# EAGLE board perfect-cell-v0.1 (EAGLE 7.3.0)
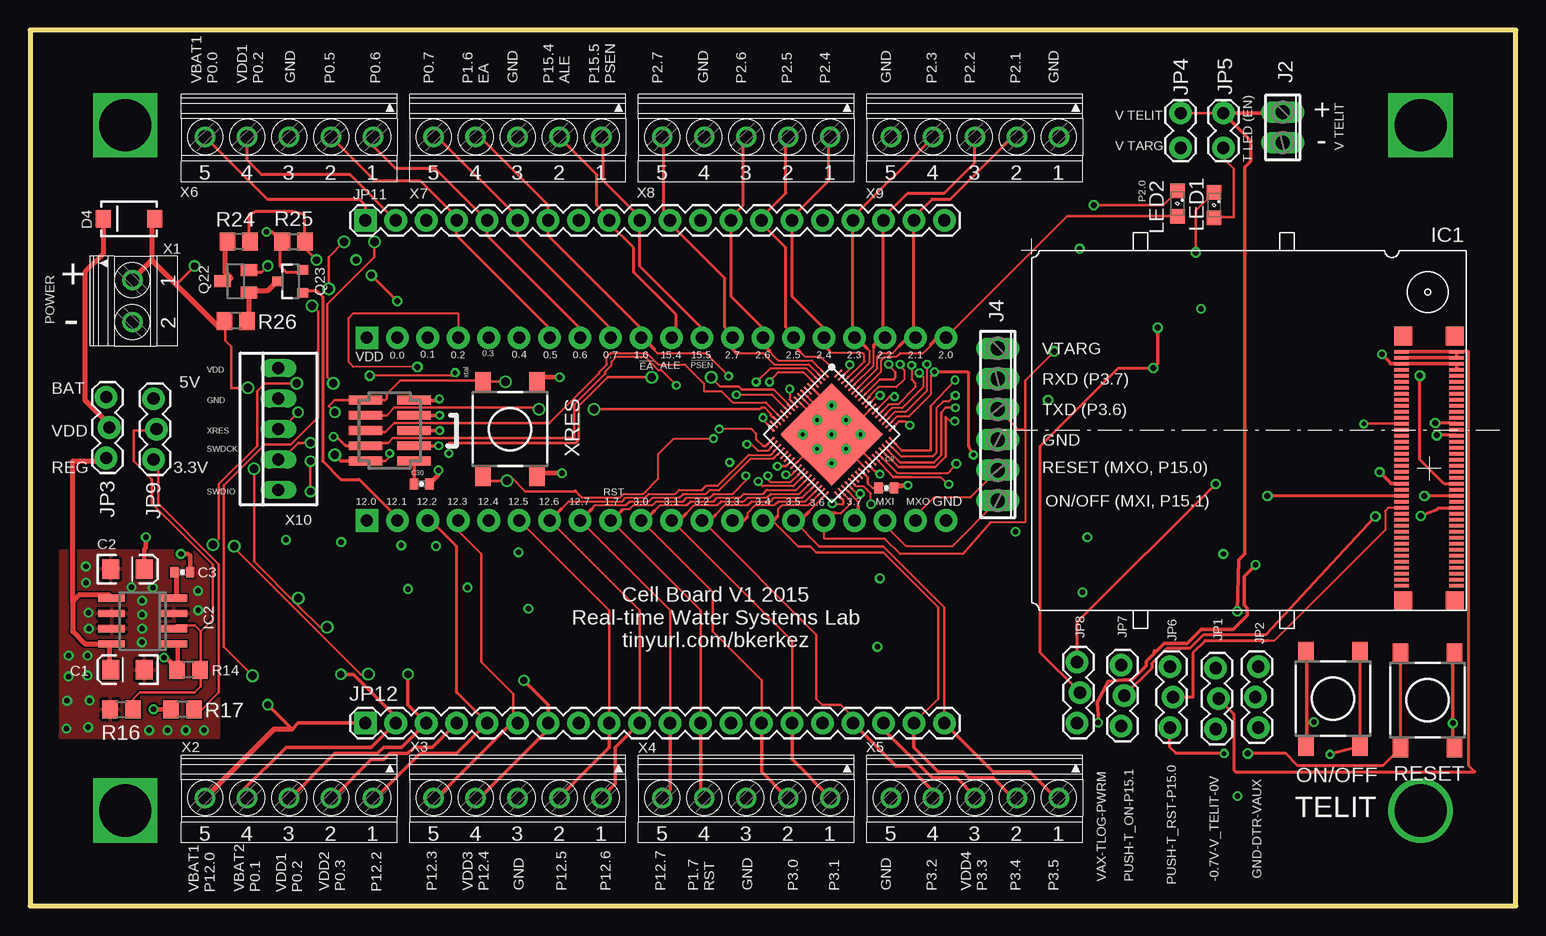
[diagram p3: board, top side]
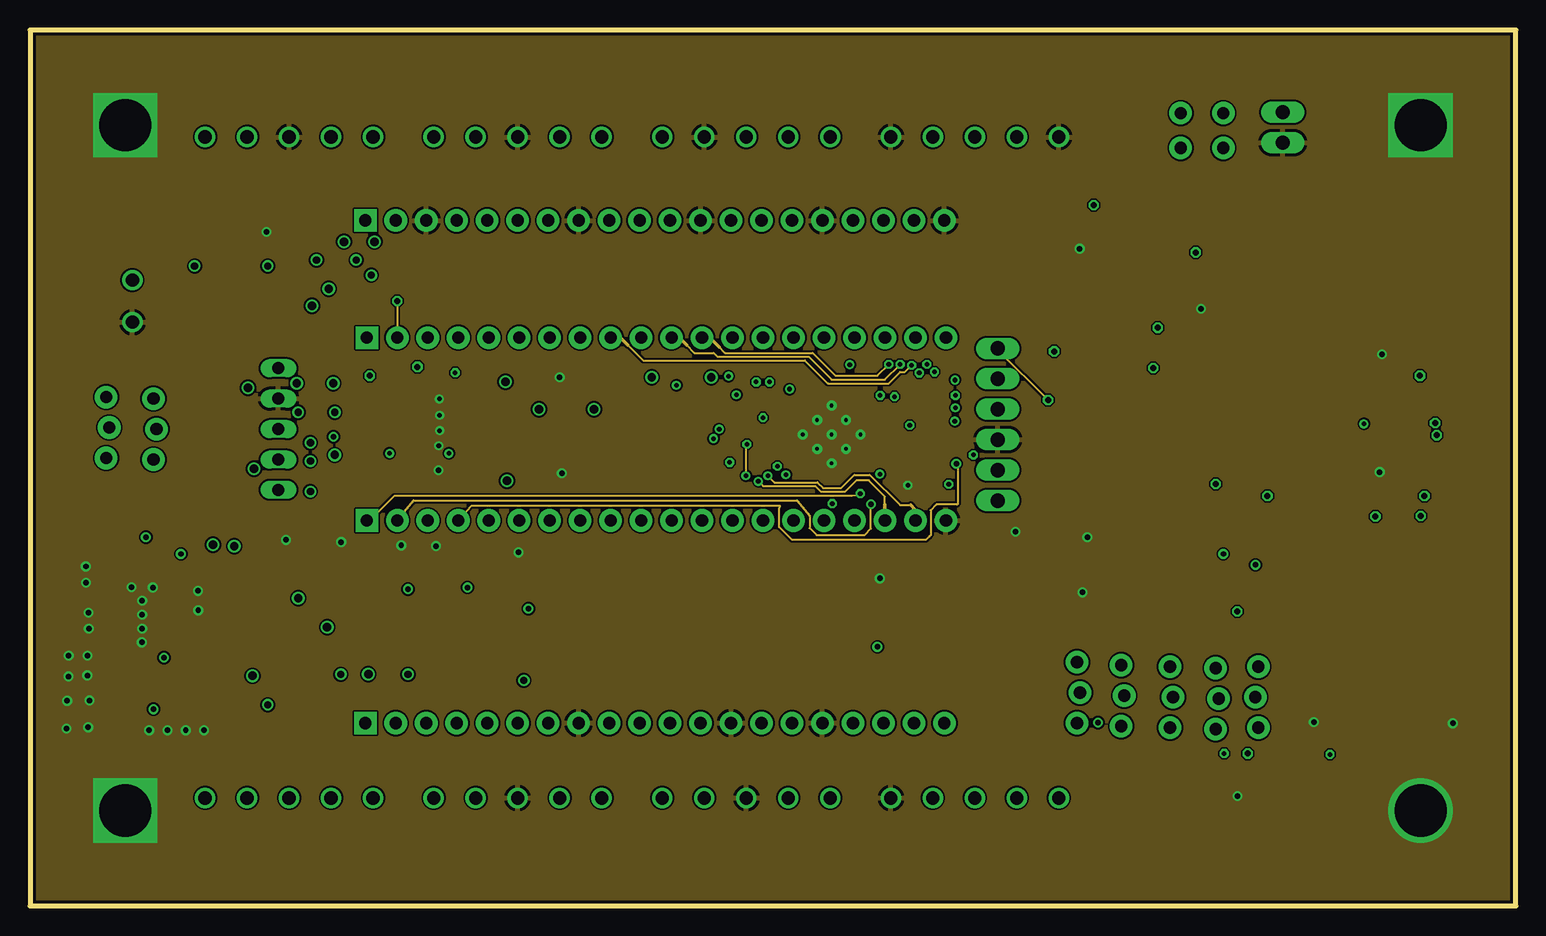
[diagram p4: board, inner layer Route2]
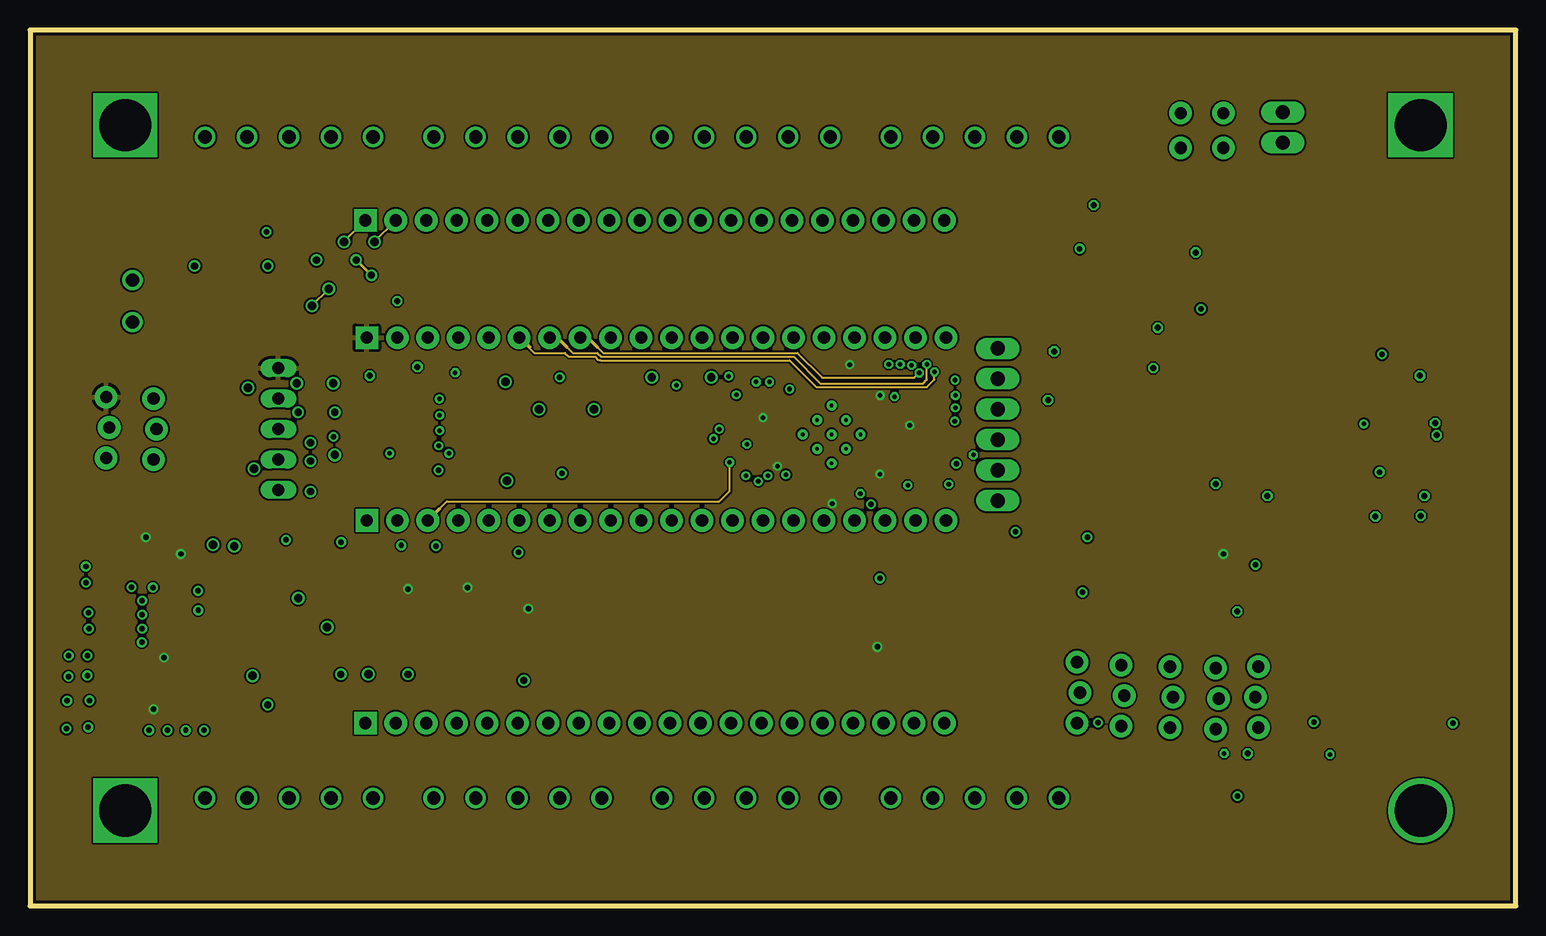
[diagram p5: board, inner layer Route15]
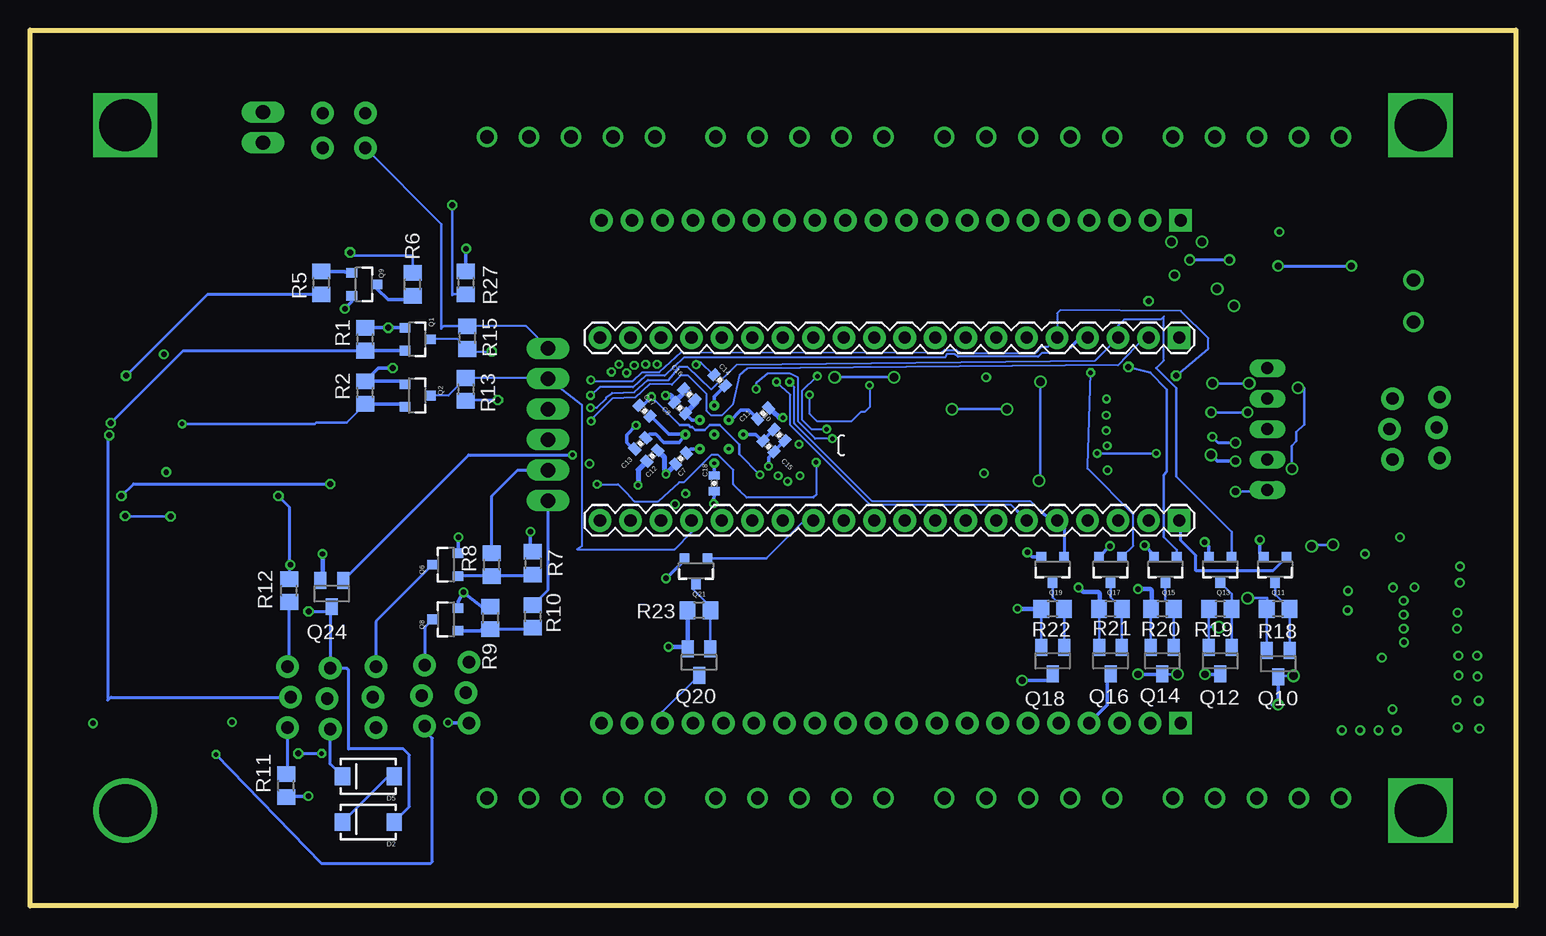
[diagram p6: board, bottom side, seen from below]

Size 123.83 x 73.03 mm. Coordinates in mm from the lower left corner, seen from the top.
Outline: 123.83,0 123.83,73.03 0,73.03 0,0 123.83,0
Copper layers (1*2+15*16): Top 0.035mm / dielectric 0.21mm / Route2 0.035mm / dielectric 0.21mm / Route15 0.035mm / dielectric 0.21mm / Bottom 0.035mm
Design rules "design_rules *": minimum track width 6mil, minimum drill 15mil, track to track 6mil, track to pad 6mil, pad to pad 6mil, via to via 6mil, smd to smd 0mil, copper to edge 10mil, drill to drill 20mil, minimum pad ring 10mil, minimum via ring 7mil, stop-mask expansion 6mil, vias tented up to drill 12mil, thermal gap 10mil

## Footprints (pad centres in the part's own frame; a part is rotated, then mirrored left to right if it is on the bottom)
EIA3216 = smd 1.4 x 1.6: A 1.4,0; C -1.4,0
0402-CAP = smd 0.7 x 0.9: 1 -0.65,0; 2 0.65,0
SMA-DIODE = smd 1.27 x 1.47: A -2.15,0; C 2.15,0
GC864 = smd 0.3 x 1.2: 1 -9.75,2.3; 2 -9.75,-2.3; 3 -9.25,2.3; 4 -9.25,-2.3; 5 -8.75,2.3; 6 -8.75,-2.3; 7 -8.25,2.3; 8 -8.25,-2.3; 9 -7.75,2.3; 10 -7.75,-2.3; 11 -7.25,2.3; 12 -7.25,-2.3; 13 -6.75,2.3; 14 -6.75,-2.3; 15 -6.25,2.3; 16 -6.25,-2.3; 17 -5.75,2.3; 18 -5.75,-2.3; 19 -5.25,2.3; 20 -5.25,-2.3; 21 -4.75,2.3; 22 -4.75,-2.3; 23 -4.25,2.3; 24 -4.25,-2.3; 25 -3.75,2.3; 26 -3.75,-2.3; 27 -3.25,2.3; 28 -3.25,-2.3; 29 -2.75,2.3; 30 -2.75,-2.3; 31 -2.25,2.3; 32 -2.25,-2.3; 33 -1.75,2.3; 34 -1.75,-2.3; 35 -1.25,2.3; 36 -1.25,-2.3; 37 -0.75,2.3; 38 -0.75,-2.3; 39 -0.25,2.3; 40 -0.25,-2.3; 41 0.25,2.3; 42 0.25,-2.3; 43 0.75,2.3; 44 0.75,-2.3; 45 1.25,2.3; 46 1.25,-2.3; 47 1.75,2.3; 48 1.75,-2.3; 49 2.25,2.3; 50 2.25,-2.3; 51 2.75,2.3; 52 2.75,-2.3; 53 3.25,2.3; 54 3.25,-2.3; 55 3.75,2.3; 56 3.75,-2.3; 57 4.25,2.3; 58 4.25,-2.3; 59 4.75,2.3; 60 4.75,-2.3; 61 5.25,2.3; 62 5.25,-2.3; 63 5.75,2.3; 64 5.75,-2.3; 65 6.25,2.3; 66 6.25,-2.3; 67 6.75,2.3; 68 6.75,-2.3; 69 7.25,2.3; 70 7.25,-2.3; 71 7.75,2.3; 72 7.75,-2.3; 73 8.25,2.3; 74 8.25,-2.3; 75 8.75,2.3; 76 8.75,-2.3; 77 9.25,2.3; 78 9.25,-2.3; 79 9.75,2.3; 80 9.75,-2.3 | smd 1.6 x 1.5: P$81 -11.05,2.15; P$82 -11.05,-2.15; P$83 11.05,2.15; P$84 11.05,-2.15
SOIC8 = smd 0.6 x 2.2: 1 -1.905,-2.6; 2 -0.635,-2.6; 3 0.635,-2.6; 4 1.905,-2.6; 5 1.905,2.6; 6 0.635,2.6; 7 -0.635,2.6; 8 -1.905,2.6
2POL254 = drill 1.2 long: 1 -1.27,0; 2 1.27,0
6POL254 = drill 1.2 pad 1.778 long: 1 -6.35,0; 2 -3.81,0; 3 -1.27,0; 4 1.27,0; 5 3.81,0; 6 6.35,0
1X03_LOCK = drill 1.016 pad 1.88: 1 0,0.127; 2 2.54,-0.127; 3 5.08,0.127
1X02_LOCK = drill 1.016 pad 1.88: 1 -0.178,0; 2 2.718,0
1X20 = drill 1.016 pad 1.88 square: 1 0,0 | drill 1.016 pad 1.88: 2 2.54,0; 3 5.08,0; 4 7.62,0; 5 10.16,0; 6 12.7,0; 7 15.24,0; 8 17.78,0; 9 20.32,0; 10 22.86,0; 11 25.4,0; 12 27.94,0; 13 30.48,0; 14 33.02,0; 15 35.56,0; 16 38.1,0; 17 40.64,0; 18 43.18,0; 19 45.72,0; 20 48.26,0
SML0805 = smd 1.2 x 1.2: A 1.05,0; C -1.05,0
DTSM-6 = smd 1.55 x 1.3: 1 -3.975,2.25; 2 3.975,2.25; 3 -3.975,-2.25; 4 3.975,-2.25
SOT23-3 = smd 0.8 x 0.9: 1 -0.95,-1; 2 0.95,-1; 3 0,1.1
FTSH-105-01-XXX-DV-K = smd 0.737 x 2.794: 1 -2.54,-2.032; 2 -2.54,2.032; 3 -1.27,-2.032; 4 -1.27,2.032; 5 0,-2.032; 6 0,2.032; 7 1.27,-2.032; 8 1.27,2.032; 9 2.54,-2.032; 10 2.54,2.032
SOT23 = smd 1 x 1.4: 1 -0.95,-1.1; 2 0.95,-1.1; 3 0,1.1
R0805 = smd 1.3 x 1.5: 1 -0.95,0; 2 0.95,0
QFN-68 = smd 0.9 x 0.2: 1 -4,3.2; 2 -4,2.8; 3 -4,2.4; 4 -4,2; 5 -4,1.6; 6 -4,1.2; 7 -4,0.8; 8 -4,0.4; 9 -4,0; 10 -4,-0.4; 11 -4,-0.8; 12 -4,-1.2; 13 -4,-1.6; 14 -4,-2; 15 -4,-2.4; 16 -4,-2.8; 17 -4,-3.2; 35 4,-3.2; 36 4,-2.8; 37 4,-2.4; 38 4,-2; 39 4,-1.6; 40 4,-1.2; 41 4,-0.8; 42 4,-0.4; 43 4,0; 44 4,0.4; 45 4,0.8; 46 4,1.2; 47 4,1.6; 48 4,2; 49 4,2.4; 50 4,2.8; 51 4,3.2 | smd 0.2 x 0.9: 18 -3.2,-4; 19 -2.8,-4; 20 -2.4,-4; 21 -2,-4; 22 -1.6,-4; 23 -1.2,-4; 24 -0.8,-4; 25 -0.4,-4; 26 0,-4; 27 0.4,-4; 28 0.8,-4; 29 1.2,-4; 30 1.6,-4; 31 2,-4; 32 2.4,-4; 33 2.8,-4; 34 3.2,-4; 52 3.2,4; 53 2.8,4; 54 2.4,4; 55 2,4; 56 1.6,4; 57 1.2,4; 58 0.8,4; 59 0.4,4; 60 0,4; 61 -0.4,4; 62 -0.8,4; 63 -1.2,4; 64 -1.6,4; 65 -2,4; 66 -2.4,4; 67 -2.8,4; 68 -3.2,4 | drill 0.305: P$1 -1.705,-1.705; P$2 0,-1.705; P$3 1.705,-1.705; P$4 1.705,0; P$5 0,0; P$6 -1.705,0; P$7 -1.705,1.705; P$8 0,1.705; P$9 1.705,1.705 | smd 6.1 x 6.1: PAD 0,0
1751248 = drill 1.1 pad 1.7: 1 -1.75,-0.1; 2 1.75,-0.1
1751277 = drill 1.1 pad 1.7: 1 -7,-0.1; 2 -3.5,-0.1; 3 0,-0.1; 4 3.5,-0.1; 5 7,-0.1
22-23-2051 = drill 1 long: 1 -5.08,0; 2 -2.54,0; 3 0,0; 4 2.54,0; 5 5.08,0

## Placement (x,y rotation side)
C1  10uF  [EIA3216]  8.13,19.68 180 top
C2  10uF  [EIA3216]  8.13,28.07 0 top
C3  0.1 uF  [0402-CAP]  12.7,27.81 180 top
C7  0.1uF  [0402-CAP]  69.58,37.29 45 bottom
C8  1.0uF  [0402-CAP]  69.67,41.51 315 bottom
C9  1.0uF  [0402-CAP]  71.36,34.83 0 top
C10  0.1uF  [0402-CAP]  61.38,39.25 135 bottom
C11  0.1uF  [0402-CAP]  62.73,41.05 225 bottom
C12  1.0uF  [0402-CAP]  71.97,37.52 225 bottom
C13  0.1uF  [0402-CAP]  72.97,38.55 45 bottom
C14  0.1uF  [0402-CAP]  66.35,43.82 315 bottom
C15  1.0uF  [0402-CAP]  62.27,38.31 135 bottom
C16  0.1uF  [0402-CAP]  68.89,42.63 315 bottom
C17  1.0uF  [0402-CAP]  72.61,41.27 315 bottom
C18  0.1uF  [0402-CAP]  66.8,35.23 90 bottom
C30  0.1uF  [0402-CAP]  32.64,35.18 0 top
D2  [SMA-DIODE]  95.63,6.99 180 bottom
D4  [SMA-DIODE]  8.26,57.28 180 top
D5  [SMA-DIODE]  95.63,10.79 180 bottom
IC1  GC864  [GC864]  116.59,36.45 270 top
IC2  LT1763CS8-3.3  [SOIC8]  9.4,23.75 90 top
J2  [2POL254]  104.39,64.9 270 top
J4  [6POL254]  80.64,40.13 270 top
JP1  [1X03_LOCK]  98.93,14.73 90 top
JP2  [1X03_LOCK]  102.23,19.94 270 top
JP3  [1X03_LOCK]  6.48,37.34 90 top
JP4  [1X02_LOCK]  95.89,65.91 270 top
JP5  [1X02_LOCK]  99.44,65.91 270 top
JP6  [1X03_LOCK]  95.12,14.86 90 top
JP7  [1X03_LOCK]  91.06,14.99 90 top
JP8  [1X03_LOCK]  87.38,15.24 90 top
JP9  [1X03_LOCK]  10.41,37.21 90 top
JP11  [1X20]  27.94,57.15 0 top
JP12  [1X20]  27.94,15.24 0 top
JP13  M20  [1X20]  28.07,32.13 180 bottom
JP14  M20  [1X20]  28.07,47.37 180 bottom
LED1  [SML0805]  98.68,58.42 270 top
LED2  [SML0805]  95.63,58.55 270 top
ON/OFF  DTSM-6  [DTSM-6]  108.58,17.27 270 top
Q1  BSS138  [SOT23-3]  91.57,47.24 270 bottom
Q2  BSS138  [SOT23-3]  91.57,42.55 270 bottom
Q3  2X5  [FTSH-105-01-XXX-DV-K]  29.97,39.62 90 top
Q6  BSS138  [SOT23-3]  89.15,28.45 90 bottom
Q8  BSS138  [SOT23-3]  89.15,23.88 90 bottom
Q9  BSS138  [SOT23-3]  96.01,51.82 270 bottom
Q10  BSS84  [SOT23]  19.81,20.19 180 bottom
Q11  BSS138  [SOT23-3]  20.07,28.07 180 bottom
Q12  BSS84  [SOT23]  24.64,20.45 180 bottom
Q13  BSS138  [SOT23-3]  24.64,28.07 180 bottom
Q14  BSS84  [SOT23]  29.46,20.45 180 bottom
Q15  BSS138  [SOT23-3]  29.21,28.07 180 bottom
Q16  BSS84  [SOT23]  33.78,20.45 180 bottom
Q17  BSS138  [SOT23-3]  33.78,28.07 180 bottom
Q18  BSS84  [SOT23]  38.61,20.45 180 bottom
Q19  BSS138  [SOT23-3]  38.61,28.07 180 bottom
Q20  BSS84  [SOT23]  68.07,20.32 180 bottom
Q21  BSS138  [SOT23-3]  68.33,27.94 180 bottom
Q22  BSS84  [SOT23]  17.14,52.07 90 top
Q23  BSS138  [SOT23-3]  21.72,52.07 90 top
Q24  BSS84  [SOT23]  98.68,26.04 180 bottom
R1  10K  [R0805]  95.89,47.24 90 bottom
R2  10K  [R0805]  95.89,42.8 90 bottom
R5  330  [R0805]  99.57,51.94 270 bottom
R6  330  [R0805]  91.95,51.82 90 bottom
R7  10K  [R0805]  81.92,28.57 270 bottom
R8  330  [R0805]  85.34,28.45 90 bottom
R9  10K  [R0805]  85.47,24 270 bottom
R10  330  [R0805]  81.92,24.13 90 bottom
R11  10K  [R0805]  102.49,10.03 90 bottom
R12  10K  [R0805]  102.23,26.29 90 bottom
R13  10K  [R0805]  87.5,43.05 270 bottom
R14  750K  [R0805]  13.21,19.68 180 top
R15  10K  [R0805]  87.38,47.37 90 bottom
R16  240K  [R0805]  7.62,16.38 0 top
R17  909K  [R0805]  12.7,16.38 180 top
R18  100K  [R0805]  19.81,24.77 180 bottom
R19  100K  [R0805]  24.64,24.77 180 bottom
R20  100K  [R0805]  29.46,24.77 180 bottom
R21  100K  [R0805]  33.78,24.77 180 bottom
R22  100K  [R0805]  38.61,24.77 180 bottom
R23  100K  [R0805]  68.07,24.64 180 bottom
R24  10K  [R0805]  17.4,55.37 180 top
R25  1K  [R0805]  21.97,55.37 0 top
R26  100K  [R0805]  17.14,48.77 180 top
R27  330  [R0805]  87.5,51.94 270 bottom
RESET  DTSM-6  [DTSM-6]  116.46,17.14 90 top
U$1  CY8C3X66LTI  [QFN-68]  66.8,39.3 315 top
X1  1751248  [1751248]  8.64,50.42 270 top
X2  1751277  [1751277]  21.59,8.89 180 top
X3  1751277  [1751277]  40.64,8.89 180 top
X4  1751277  [1751277]  59.69,8.89 180 top
X5  1751277  [1751277]  78.74,8.89 180 top
X6  1751277  [1751277]  21.59,64.01 180 top
X7  1751277  [1751277]  40.64,64.01 180 top
X8  1751277  [1751277]  59.69,64.01 180 top
X9  1751277  [1751277]  78.74,64.01 180 top
X10  22-23-2051  [22-23-2051]  20.7,39.75 90 top
XRES  DTSM-6  [DTSM-6]  40.01,39.75 90 top

## Tracks (layer width: path | path; a pad name or v marks a point on that pad's centre or on a via)
!EA  (via drill 0.38)
  Top 0.152: U$1.18 61.77,38.8 | v58.22,44.16 56.33,46.1 52.28,46.1 51.32,47.05 JP14.10
  Top 0.178: 60.53,38.88 60.53,39.35 60.13,39.75 v57.44,39.75
  Top 0.203: U$1.18 61.3,38.32 61.09,38.32 60.53,38.88
  Top 0.254: JP14.10 51.31,47.75 43.18,55.88 JP11.7 43.18,58.42 37.59,64.01 X7.4
  Top 0.305: 51.32,47.05 51.4,47.05 52.04,46.42
  Bottom 0.152: v57.44,39.75 58.71,39.75 59.5,40.55 59.5,42.93 v58.22,44.16
!PSEN  (via drill 0.38)
  Top 0.203: 71.56,45.19 v71.56,45.15 71.56,45.07 72.12,44.51 72.12,44.04 71.96,43.88 70.81,43.88 U$1.61
  Top 0.254: JP14.12 56.39,47.75 50.8,53.34 JP11.10 50.8,57.4 47.75,60.45 47.75,64.01 X7.1
  Route2 0.152: 57.44,46.58 57.91,46.1 65.22,46.1 67.12,44.2 70.61,44.2 v71.56,45.15 | JP14.12 56.64,47.37
  Route2 0.305: 56.64,47.37 57.44,46.58
!XRES  (via drill 0.38, 0.6, 0.7)
  Top 0.152: 45.53,34.51 45.74,34.31 46.01,34.04 49.18,34.04 49.5,34.35 51.09,34.35 52.36,35.62 52.36,37.69 53.63,38.96 v56.96,38.96 | v56.96,38.96 | v63.31,43.09 63.31,42.23
  Top 0.203: 45.43,34.62 45.53,34.51 | 63.31,42.23 U$1.10 | v22.35,41.15 21.34,40.13 20.83,40.13 X10.3 | v25.4,41.15 24.89,41.66 25.4,42.16 Q3.10 29.59,42.16 29.72,42.29 29.72,42.67 30.86,43.81 37.67,43.81 XRES.2 39.59,43.73 v39.62,43.69 | 45.74,34.31 45.5,34.54 41.27,34.54 40.04,35.78 40.04,35.73 v39.75,35.43 38.1,35.43 XRES.1
  Bottom 0.152: v56.96,38.96 58.39,38.96 59.82,40.39 59.82,44.04 60.45,44.37 62.36,44.37 63.31,43.57 v63.31,43.09
  Bottom 0.203: v25.4,41.15 v22.35,41.15 | v39.62,43.69 39.62,35.56 v39.75,35.43
ALE  (via drill 0.38)
  Top 0.152: v72.52,45.15 72.52,45.02 72.83,44.67 72.83,43.88 72.2,43.24 70.69,43.24 69.98,42.53 69.98,42.45 | 69.59,42.06 U$1.60
  Top 0.203: 69.98,42.45 69.59,42.06
  Top 0.254: JP14.11 53.85,47.75 53.85,49.28 50.29,52.83 50.29,54.86 48.26,56.9 JP11.9 48.26,57.4 47.24,58.42 47.24,60.96 44.2,64.01 X7.2
  Route2 0.152: v72.52,45.15 71.25,43.88 66.8,43.88 64.9,45.78 57.28,45.78 56.96,46.1 55.37,46.1 54.74,46.74 | JP14.11 54.02,47.37
  Route2 0.305: 54.02,47.37 54.1,47.37 54.74,46.74
DTR  (via drill 0.5)
  Top 0.254: IC1.29 118.84,39.24 v117.22,39.24
  Bottom 0.254: v117.22,39.24 117.35,39.12 117.35,17.14 117.09,17.4 JP2.2
GND  (via drill 0.38, 0.46, 4.34)
  Top 0.152: 64.78,37.85 64.9,37.85 66.35,39.3 U$1.P$5 | U$1.5 66.8,41.56 U$1.P$5 | U$1.P$5 66.8,40.43 | U$1.P$5 66.8,39.87
  Top 0.203: U$1.25 64.78,37.85 | 66.8,40.43 U$1.7 | 66.8,39.87 U$1.8 | U$1.P$5 U$1.9 | C9.2 71.88,35.03 | 67.12,36.1 66.8,36.42 U$1.P$3 | U$1.45 69.14,38.1 U$1.P$4 U$1.43 | U$1.58 69.14,40.51 U$1.P$8
  Top 0.254: U$1.5 66.08,42.29 66.72,42.37 | Q23.2 22.35,52.83 21.34,52.83 20.83,53.34 20.83,55.37 R25.1
  Top 0.305: ON/OFF.4 106.4,13.36 106.4,15.24 | 106.4,15.24 106.48,15.32 v106.98,15.32 | RESET.3 118.57,13.31 v118.57,15.21 118.57,20.98 RESET.4 | ON/OFF.3 106.43,21.16 106.43,20.88 106.4,20.85 106.4,15.24 | IC1.7 IC1.5 IC1.6 113.37,45.2 113.33,45.24 113.33,45.31 v112.67,45.97 | IC1.46 113.39,35.2 113.39,35.25 v112.47,36.17 | Q3.7 v34.14,40.89 | Q3.5 v34.14,39.62 | Q3.3 v34.06,38.35 | Q3.9 32,42.14 31.98,42.11 33.96,42.11 v34.11,42.27 | R25.1 20.21,56.19 v19.71,56.19
  Top 0.356: XRES.3 42.55,36.07 v44.32,36.07 | XRES.4 42.6,44.07 v44.15,44.07 | C30.2 34.04,35.93 v34.04,36.32
  Top 0.406: 67.28,36.42 67.12,36.1 | 71.88,35.03 72.64,35.03 v73.15,35.07
  Bottom 0.305: C13.2 72.17,39.33 71.7,39.33 71.01,38.64 69.73,38.64 U$1.P$9 69.28,39.35 70.61,39.35 72.07,40.81 C17.2 | C11.2 63.94,41.34 64.58,41.34 65.48,40.44 U$1.P$6 | C10.2 62.73,38.83 | 62.73,38.83 C15.2 | U$1.P$3 66.8,37.03 C18.2 | 62.73,38.83 62.76,38.8 62.83,38.8 63.34,39.3 U$1.P$1 | C14.2 66.8,42.45 U$1.P$7 | C8.2 68.67,40.51 U$1.P$8 | C7.2 68.77,38.1 U$1.P$4 | R11.1 102.43,9.14 v100.64,9.14 | R27.1 87.5,54.76 v87.48,54.79 | Q9.2 97.01,50.36 v97.59,49.78 | R9.1 86.22,24.95 v87.71,26.14 88.15,25.38 Q8.2 | R7.1 82.15,29.52 v82.12,31.19 | Q6.2 88.15,30.69 v88.11,30.73 | Q15.2 30.16,29.27 v30.94,30.05 | Q17.2 34.73,29.1 v33.83,30 | Q19.2 40.32,29.07 v40.72,29.46 | Q13.2 25.59,29.98 v25.93,30.33 | Q21.2 69.28,28.84 v70.81,27.3 | Q11.2 21.34,29.39 v21.34,30.5
  Bottom 0.406: C8.2 68.24,42.01 C16.2 | C14.2 65.93,43.36 66.09,43.16 | C12.2 73.15,36.34 v73.15,35.07
  other vias: 7.94,7.94 7.94,65.09 115.89,65.09 115.89,7.94 9.35,25.45 9.35,24.28 9.35,23.11 9.32,21.97 4.88,24.43 4.9,23.11 14,26.26 14.02,24.64 10.24,26.54 8.46,26.57 4.8,20.85 4.67,26.95 4.78,19.2 4.95,17.12 4.85,14.88 3.05,14.78 3.1,17.09 3.2,19.13 3.23,20.85 4.65,28.3 9.93,14.63 11.46,14.63 12.98,14.63 14.5,14.63
  pour Route2: 0,0 123.83,0 123.83,73.03 0,73.03
  pour Top: 2.57,29.59 15.75,29.59 15.75,14.05 2.51,14.05 2.51,14.33 2.57,14.33 2.57,29.57
MXI  (via drill 0.38)
  Top 0.152: U$1.28 63.62,34.99 61.01,34.99 60.69,35.31 v60.69,35.38 | J4.6 76.83,29.97 73.03,29.97 71.25,31.75 JP13.18
  Route2 0.152: JP13.18 71.25,32.61 | 71.25,33.48 71.25,34.12 69.9,35.47 68.87,35.47 67.91,34.51 65.93,34.51 65.45,34.99 61.09,34.99 v60.69,35.38
  Route2 0.305: 71.25,32.61 71.25,33.48
  Bottom 0.254: R10.2 80.64,26.35 J4.6
MXO  (via drill 0.38)
  Top 0.152: U$1.27 63.37,35.31 61.72,35.31 61.48,35.54 v61.48,35.86 | J4.5 78.36,34.04 75.31,34.04 73.79,32.51 JP13.19
  Route2 0.152: 73.79,32.92 73.79,32.77 JP13.19 | 73.39,33.4 72.52,33.4 69.98,35.94 68.71,35.94 67.6,34.83 66.09,34.83 65.61,35.31 62.04,35.31 v61.48,35.86
  Route2 0.305: 73.79,32.77 73.79,33 73.39,33.4
  Bottom 0.254: R8.2 85.34,34.16 83.19,36.32 J4.5
N$1
  Bottom 0.254: R7.2 82.04,27.5 R8.1 Q6.1
N$2
  Top 0.254: JP1.2 100.33,16 100.33,11.3 100.46,11.18 120.4,11.18 119.89,11.68 119.89,46.23 119.86,46.2 IC1.1
  Top 0.305: IC1.2 IC1.1 IC1.3 IC1.4
N$3
  Bottom 0.254: D2.C 93.97,10.79 D5.A
N$4
  Bottom 0.305: R6.1 92.27,50.55 93.98,50.55 94.91,51.48 Q9.3
N$5
  Top 0.406: JP3.2 6.6,40.13 4.57,42.16 4.57,52.83 6.1,54.36 6.1,56.9 D4.C
N$7
  Top 0.203: LED1.A 98.71,57.4 100.33,57.4 100.33,61.47 99.44,62.36 JP5.2
N$8  (via drill 0.5)
  Top 0.203: LED1.C 97.16,57.95 v97.16,54.48
  Bottom 0.203: v97.16,54.48 96.9,54.23 91.95,54.23 R6.2
N$9
  Bottom 0.254: R10.1 82.04,23.05 R9.2
  Bottom 0.305: Q8.1 88.14,22.94 86.31,22.94 86.18,23.06 85.57,23.06 R9.2
N$10
  Bottom 0.305: Q9.1 97.08,52.83 97.54,52.83 97.6,52.89 R5.1
N$11
  Bottom 0.254: JP2.1 102.23,20.07 R12.1
N$13
  Bottom 0.254: R11.2 102.36,11.11 JP2.3
N$14
  Bottom 0.254: D5.C 98.81,11.82 JP1.1
N$15
  Bottom 0.254: Q8.3 90.93,23.2 JP7.3
N$16
  Bottom 0.203: Q11.3 20.07,25.97 R18.1 Q10.1
N$17
  Bottom 0.254: Q6.3 95,23.71 JP6.3
N$18
  Top 0.406: 6.6,21.84 6.6,19.81 C1.A | 6.6,21.84 4.57,21.84 3.56,22.86 3.56,25.4 | 3.56,25.4 4.06,25.91 6.6,25.91 IC2.5 | 6.6,21.84 IC2.8 | 3.56,25.4 3.56,37.08 6.1,37.08 JP3.1
N$19
  Bottom 0.203: Q12.1 R19.1 23.69,26.02 Q13.3
N$20
  Top 0.406: IC2.4 12.19,25.91 12.19,27.43 C3.2
N$21  (via drill 0.38)
  Top 0.254: ON/OFF.1 ON/OFF.2 109.55,12.98 v108.33,12.62
  Bottom 0.254: v108.33,12.62 99.57,3.56 90.42,3.56 90.3,3.68 90.3,13.97 90.93,14.61 JP7.1
N$22
  Bottom 0.203: Q14.1 R20.1 29.21,25.46 Q15.3
N$23
  Bottom 0.203: Q16.1 R21.1 33.78,25.71 Q17.3
N$24
  Bottom 0.203: Q19.3 38.61,25.71 R22.1 Q18.1
N$25
  Bottom 0.203: Q21.3 68.58,26.59 68.58,26.42 67.12,24.96 R23.1 Q20.1
N$26
  Top 0.406: R26.1 18.29,48.77 18.29,50.8 Q22.1 18.29,51.31 19.81,51.31 20.32,51.82 Q23.3
N$27
  Top 0.406: R24.2 16.26,55.37 16.26,52.83 16.76,52.32 16.26,51.82 Q22.3
N$29  (via drill 0.5)
  Top 0.203: LED2.C 94.45,58.42 v88.65,58.42
  Bottom 0.203: v88.65,58.42 88.65,50.93 88.58,50.99 R27.2
N$35
  Top 0.203: U$1.42 69.82,35.72 69.82,35.23 70.22,34.83 C9.1
N$39  (via drill 0.38, 0.5)
  Top 0.254: RESET.2 RESET.1 112.72,11.68 105.66,11.68 104.65,12.7 v101.47,12.7 | v99.52,12.7 95.5,12.7 95,13.21 JP6.1
  Bottom 0.254: v101.47,12.7 v99.52,12.7
P0.0  (via drill 0.38 pad 0.3, 0.5, 0.6)
  Top 0.152: 76.33,40.77 76.83,40.26 v77.06,40.41
  Top 0.203: U$1.48 71.08,37.89 72.39,36.58 75.44,36.58 76.33,37.47 76.33,40.77
  Top 0.254: 22.86,55.37 22.86,57.66 21.84,57.91 18.8,57.91 18.29,57.66 18.29,55.37 R24.1 | v28.45,52.58 v30.61,50.42 | v23.88,53.85 22.86,54.86 22.86,55.37 | 22.86,55.37 R25.2
  Route2 0.152: v30.61,50.42 JP14.2
  Route15 0.254: v27.18,53.85 v28.45,52.58
  Bottom 0.152: JP14.2 30.99,47.37 33.15,45.09 64.06,44.81 64.72,44.2 65.28,41.78 66.17,40.89 67.06,40.89 67.44,41.27 67.44,42.67 68.96,44.2 69.6,44.2 70.33,43.46 72.16,43.51 73.38,42.39 75.31,42.29 76.83,40.77 v77.06,40.41
  Bottom 0.254: v23.88,53.85 v27.18,53.85
P0.1  (via drill 0.38 pad 0.3)
  Top 0.203: U$1.49 71.33,38.15 72.52,36.96 75.31,36.96 75.95,37.59 75.95,41.15 76.33,41.53 v77.11,41.53
  Bottom 0.152: v77.11,41.53 76.58,41.53 75.82,42.29 75.82,42.42 75.31,42.77 73.46,42.82 72.34,43.84 70.61,43.84 69.7,44.96 69.06,44.96 67.06,43.05 64.95,45.11 35.05,45.47 JP14.3 33.15,48.39 32.64,48.9 29.59,48.9 29.34,49.15 29.34,45.47 29.97,44.83
  Bottom 0.203: Q13.1 23.69,31.18 28.32,35.81 28.32,43.18 29.97,44.83
P0.2  (via drill 0.38, 0.5)
  Top 0.152: 72.91,37.45 75.22,37.45 75.53,37.77 75.53,41.5 76.09,42.05 76.56,42.05 v77.11,42.55 | v32.28,44.93 26.92,44.96 26.54,45.34 26.54,49.02 26.92,49.4 35.69,49.4 JP14.4
  Top 0.203: U$1.50 72.61,37.45 72.91,37.45
  Bottom 0.152: v77.11,42.55 76.33,43.24 73.57,43.24 72.52,44.2 70.93,44.2 69.34,45.73 47.55,45.73 47.43,46 46.8,46 46.48,45.78 39.81,45.78 39.5,46.1 37.59,46.1 37.12,46.58 | JP14.4 36.32,47.37
  Bottom 0.203: Q15.1 28.26,29.66 29.34,30.73 29.34,35.94 29.08,36.2 29.08,43.05 30.48,44.45 v32.28,44.93
  Bottom 0.305: 36.32,47.37 37.12,46.58
P0.3  (via drill 0.38, 0.38 pad 0.41, 0.5)
  Top 0.152: 38.23,46.74 JP14.5 | v35.43,44.45 35.18,44.2 v28.32,44.2
  Top 0.203: U$1.51 71.89,38.72 72.64,37.97 75.06,37.97 75.06,41.66 v77.09,43.84
  Bottom 0.152: 76.89,43.76 73.58,43.76 72.8,44.5 71.37,44.5 69.55,46.18 47.9,46.13 47.62,46.35 46.63,46.35 46.23,46.1 40.01,46.1 39.5,46.61 38.99,46.61 JP14.5 38.23,49.4 37.97,49.66 27.91,49.61 25.63,47.32 25.63,46.48 v28.32,44.2 | Q17.1 31.88,30.02 31.88,32.64 35.69,36.45 35.69,36.68 v35.43,44.45
  Bottom 0.203: v77.09,43.84 77.04,43.92 76.89,43.76
P0.4  (via drill 0.38)
  Top 0.152: 72.24,40.78 73.23,40.78 75.06,42.61 75.06,44.2 v75.37,44.51
  Top 0.178: 72.24,40.78 U$1.53
  Top 0.254: v78.61,37.59 78.23,38.35 78.23,44.45 78.17,44.51 v75.37,44.51
  Route15 0.152: v75.37,44.51 75.37,43.88 74.74,43.24 65.53,43.24 63.31,45.47 47.54,45.48 47.41,45.48 47.09,45.79 44.9,45.78 44.58,46.1 42.04,46.1 JP14.6
  Route15 0.305: JP14.6 40.85,47.37 41.64,46.58
  Bottom 0.254: Q24.1 87.27,37.59 v78.61,37.59
P0.5  (via drill 0.38)
  Top 0.152: 72.07,41.18 72.99,41.18 74.74,42.93 v74.74,45.15
  Top 0.178: 72.07,41.18 U$1.54
  Top 0.254: JP14.7 43.69,47.75 35.56,55.88 JP11.4 35.56,57.4 32.51,60.45 28.75,60.45 X6.2
  Route15 0.152: v74.74,45.15 74.74,43.88 74.42,43.56 65.85,43.56 63.63,45.78 47.59,45.78 47.28,46.1 45.21,46.1 44.74,46.58 | JP14.7 43.94,47.37
  Route15 0.305: 43.94,47.37 44.74,46.58
P0.6  (via drill 0.38)
  Top 0.152: 71.83,41.5 72.68,41.5 74.42,43.24 74.42,44.12 v74.11,44.43
  Top 0.178: 71.83,41.5 U$1.55
  Top 0.254: JP14.8 46.23,47.75 38.1,55.88 JP11.5 33.78,61.47 30.48,61.47 28.59,63.36 X6.1
  Route15 0.152: v74.11,44.43 73.71,44.04 66.01,44.04 63.94,46.1 47.75,46.1 47.28,46.58 | JP14.8 46.48,47.37
  Route15 0.305: 46.48,47.37 47.28,46.58
P0.7  (via drill 0.38)
  Top 0.152: 71.58,41.81 72.36,41.81 73.79,43.24 73.79,43.56 73.47,43.88 v73.47,45.07
  Top 0.203: 71.58,41.81 U$1.56
  Top 0.254: JP14.9 48.77,47.75 40.64,55.88 JP11.6 40.64,57.4 34.04,64.01 X7.5
  Route2 0.152: v73.47,45.07 72.91,44.51 72.52,44.51 71.56,43.56 66.48,43.56 64.58,45.47 51.09,45.47 49.18,47.37 JP14.9
  Route2 0.305: 49.18,47.37 49.82,46.74
P1.0  (via drill 0.38)
  Top 0.152: U$1.38 68.73,34.54 v69.19,34.37
  Route2 0.152: v69.19,34.37 69.29,34.24 68.5,34.19 30.35,34.16 28.32,32.13 JP13.1
  Route15 0.152: JP13.1 28.3,32.37
  Bottom 0.254: Q11.1 20.24,27.94 26.67,27.94 26.67,29.21 27.94,30.48 27.94,31.75 28.07,31.88 JP13.1
P1.1  (via drill 0.46)
  Top 0.178: v70.08,33.48 70.08,34.37 69.47,34.98 68.86,34.98 U$1.39
  Top 0.254: JP13.2 30.48,32.51 27.43,35.56 25.91,35.56 24.38,37.08 24.38,50.8 23.88,51.31 22.86,51.31 Q23.1
  Route2 0.178: JP13.2 31.98,33.81 63.91,33.81 64.97,32.49 64.97,31.5 65.56,30.91 69.55,30.91 70.08,31.45 v70.08,33.48
P1.2  (via drill 0.38)
  Top 0.152: 73.48,35.73 75.85,35.73 v76.56,35.15
  Top 0.203: U$1.46 71.94,35.73 73.48,35.73
  Top 0.254: JP13.3 33.53,32 35.56,29.97 35.56,17.78 JP12.5
  Top 0.305: JP12.5 35.56,12.7 32.51,12.7 28.96,9.14 X2.1
  Route15 0.152: v58.31,36.97 58.31,34.59 57.44,33.72 34.73,33.72 34.1,33.08 | JP13.3 33.38,32.37
  Route15 0.305: 33.38,32.37 34.1,33.08
  Bottom 0.152: v58.31,36.97 58.31,34.27 58.55,34.04 64.1,34.04 64.66,34.59 65.22,35.15 65.22,36.34 66.48,37.61 67.04,37.61 69.34,35.31 69.74,35.31 71.48,33.72 73.47,33.72 74.11,34.43 74.82,35.15 v76.56,35.15
P1.3  (via drill 0.46)
  Top 0.178: U$1.47 72.26,36.09 76.5,36.09 v77.19,36.85
  Top 0.203: JP13.4 35.69,31.24 37.59,29.34 37.59,20.32 40.26,17.65 40.26,15.62 JP12.6
  Top 0.305: JP12.6 40.13,15.24 34.04,9.14 X3.5
  Route2 0.178: v77.19,36.85 77.29,36.75 77.29,33.48 77.27,33.45 75.54,33.45 75.06,32.97 75.06,30.89 74.95,30.79 74.93,30.79 74.65,30.5 63.5,30.5 62.43,31.57 62.43,33.15 62.51,33.35 36.78,33.35 JP13.4
P1.4  (via drill 0.38)
  Top 0.152: 64.67,44.83 61.72,44.83 v60.52,43.67
  Top 0.178: 64.67,44.83 U$1.3
  Bottom 0.152: v60.52,43.67 60.13,43.24 60.13,40.23 53.63,33.72 40.45,33.72 38.86,32.13 JP13.5
  Bottom 0.254: JP13.5 37.59,31.5 37.59,29.46 Q19.1
  Bottom 0.305: 38.86,32.13 38.86,32.21 39.58,32.92
P1.5  (via drill 0.38)
  Top 0.152: v61.62,43.67 62.36,44.51 64.42,44.51
  Top 0.178: 64.42,44.51 U$1.4
  Top 0.203: JP12.9 48.26,24.64 JP13.6
  Top 0.305: JP12.9 48.26,13.21 44.2,9.14 X3.2
  Bottom 0.152: v61.62,43.67 60.45,42.61 60.45,40.07 53.78,33.4 42.04,33.4 41.56,32.92 | JP13.6 41.08,32.45
  Bottom 0.305: 41.08,32.45 41.56,32.92
P1.6
  Top 0.152: 61.79,37.69 61.79,37.68 61.72,37.61 59.9,37.61 57.28,34.99 56.33,34.99 56.01,34.67 54.1,34.67 53.78,34.35 51.56,34.35 51.24,34.04 49.66,34.04 49.34,33.72 44.9,33.72 44.26,33.08 | JP13.7 43.78,32.61
  Top 0.203: 61.79,37.69 U$1.20 | JP12.10 50.8,24.64 JP13.7
  Top 0.305: 43.78,32.61 44.26,33.08 | X3.1 47.75,9.14 48.77,10.16 48.77,13.21 JP12.10
P1.7
  Top 0.152: 62.04,37.37 61.96,37.29 60.05,37.29 57.44,34.67 56.64,34.67 56.33,34.35 54.42,34.35 54.1,34.04 51.88,34.04 51.56,33.72 49.97,33.72 49.66,33.4 47.12,33.4 46.8,33.08 | JP13.8 46.24,32.53
  Top 0.203: 62.04,37.37 U$1.21 | JP12.11 53.34,24.64 JP13.8
  Top 0.305: 46.24,32.53 46.8,33.08 | JP12.11 53.34,9.65 52.83,9.14 X4.5
P2.0
  Top 0.152: 70.93,44.56 70.93,45.47 71.25,45.78 72.2,45.78 72.52,46.1 74.42,46.1 75.69,47.37
  Top 0.178: U$1.62 70.93,44.56
  Top 0.203: JP14.20 86.45,57.5 LED2.A
  Top 0.305: 75.06,46.81 75.53,47.29 75.69,47.29 75.77,47.37 JP14.20 75.69,47.37
P2.1
  Top 0.152: 70.61,44.81 70.61,45.78 70.93,46.1 71.88,46.1 72.44,46.66 | 73.15,47.37 JP14.19
  Top 0.178: U$1.63 70.61,44.81
  Top 0.254: JP14.19 73.66,47.75 JP11.19 73.66,57.4 75.18,58.93 76.71,58.93 81.79,64.01 X9.2
  Top 0.305: 72.44,46.66 73.15,47.37
P2.2
  Top 0.152: 70.29,45.06 70.29,46.58 | 70.93,47.37 JP14.18
  Top 0.178: U$1.64 70.29,45.06
  Top 0.254: JP14.18 71.12,47.75 JP11.18 71.12,57.4 73.15,59.44 76.2,59.44 78.74,61.98 X9.3
  Top 0.305: 70.29,46.58 70.29,46.74 70.93,47.37
P2.3
  Top 0.152: 69.98,45.3 69.98,46.26 68.87,47.37 | 68.87,47.37 | 68.87,47.37 JP14.17
  Top 0.178: U$1.65 69.98,45.3
  Top 0.254: JP14.17 68.58,47.75 JP11.17 68.58,57.4 75.18,64.01 X9.4
  Top 0.305: 68.87,47.37 69.74,46.5
P2.4
  Top 0.152: 69.5,45.4 69.5,45.94 69.34,46.1 66.8,46.1 66.56,46.34 | 66.17,46.74 JP14.16
  Top 0.203: U$1.66 69.5,45.4
  Top 0.254: JP14.16 66.55,47.75 63.5,50.8 JP11.15 63.5,57.4 66.55,60.45 66.55,64.01 X8.1
  Top 0.305: 66.17,46.74 66.56,46.34
P2.5
  Top 0.152: 64.18,46.18 64.58,45.78 65.84,45.78 | JP14.15 63.63,46.74
  Top 0.203: 65.84,45.78 U$1.68
  Top 0.254: JP14.15 63.5,47.75 62.99,48.26 62.99,54.86 60.96,56.9 JP11.14 60.96,57.4 62.99,59.44 62.99,64.01 X8.2
  Top 0.305: 63.63,46.74 64.18,46.18
P2.6
  Top 0.152: 65.16,45.47 62.36,45.47 61.09,46.74 JP14.14
  Top 0.178: 65.16,45.47 U$1.1
  Top 0.254: JP14.14 61.47,47.75 58.42,50.8 JP11.13 58.42,57.4 59.44,58.42 59.44,64.01 X8.3
  Top 0.305: 61.09,46.74 61.17,46.74 61.64,46.26
P2.7
  Top 0.152: 64.92,45.15 62.04,45.15 61.09,46.1 58.86,46.1 | JP14.13 58.55,47.05
  Top 0.178: 64.92,45.15 U$1.2
  Top 0.254: JP14.13 58.42,47.75 57.91,48.26 57.91,52.32 53.34,56.9 JP11.11 53.34,57.4 52.83,57.91 52.83,64.01 X8.5
  Top 0.305: 58.55,47.05 58.55,46.42 58.86,46.1
P3.0
  Top 0.152: 63.87,34.67 61.4,34.67 61.09,34.35 59.5,34.35 59.18,34.04 57.28,34.04 56.96,33.72 55.05,33.72 54.74,33.4 52.51,33.4 52.04,32.92 | 51.48,32.37 51.24,32.13 JP13.10
  Top 0.178: 63.87,34.67 U$1.29
  Top 0.203: JP13.10 56.9,26.16 56.9,22.86 60.96,18.8 60.96,14.73
  Top 0.305: 51.48,32.37 52.04,32.92 | JP12.14 60.96,14.73 60.96,11.18 62.99,9.14 X4.2
P3.1
  Top 0.152: 64.12,34.35 61.72,34.35 61.4,34.04 59.82,34.04 59.5,33.72 57.59,33.72 57.28,33.4 55.37,33.4 54.66,32.69 | JP13.11 54.1,32.13
  Top 0.178: 64.12,34.35 U$1.30
  Top 0.203: JP13.11 63.5,22.1 JP12.15
  Top 0.305: 54.1,32.13 54.66,32.69 | JP12.15 63.5,12.19 66.55,9.14 X4.1
P3.2
  Top 0.152: 64.36,34.04 62.04,34.04 61.72,33.72 60.13,33.72 59.82,33.4 57.91,33.4 57.12,32.61 | JP13.12 56.64,32.13
  Top 0.178: 64.36,34.04 U$1.31
  Top 0.203: JP13.12 65.53,22.61 65.53,17.27 66.04,16.76 67.56,16.76 68.58,15.75 JP12.17
  Top 0.305: 56.64,32.13 57.12,32.61 | X5.4 75.69,9.14 73.15,11.68 72.14,11.68 JP12.17
P3.3
  Top 0.152: 64.61,33.72 62.36,33.72 62.04,33.4 60.45,33.4 59.82,32.77 59.82,32.45 59.74,32.37 | JP13.13 59.18,32.13
  Top 0.178: 64.61,33.72 U$1.32
  Top 0.305: 59.18,32.13 59.5,32.13 59.74,32.37
  Bottom 0.203: Q21.1 67.36,28.96 62.48,28.96 59.31,32.13 JP13.13
P3.4
  Top 0.152: 64.86,33.4 62.67,33.4 62.36,33.08 62.36,32.45 62.04,32.13 61.64,32.13 JP13.14
  Top 0.203: 64.86,33.4 U$1.33 | JP12.19 75.69,17.27 75.69,24.89 71.12,29.46 65.53,29.46 65.02,29.97 64.01,29.97 61.98,32 JP13.14
  Top 0.305: 61.64,32.13 61.96,32.13 62.28,32.45 | JP12.19 73.66,13.21 75.69,11.18 77.72,11.18 78.23,10.67 80.26,10.67 81.79,9.14 X5.2
P3.5
  Top 0.152: JP13.15 64.1,32.13 64.16,32.13
  Top 0.203: 64.16,32.13 U$1.34 | JP12.20 76.2,24.89 71.12,29.97 65.79,29.97 JP13.15
  Top 0.305: 64.1,32.13 64.18,32.13 64.9,32.84 | JP12.20 80.26,11.18 83.31,11.18 85.34,9.14 X5.1
P3.6  (via drill 0.5)
  Top 0.152: 67.75,32.92 68.39,33.56 68.39,33.75 U$1.36 | 67.75,32.92 67.6,32.77 67.12,32.77 66.72,32.84 66.56,32.84 66.48,32.77 66.17,32.45 JP13.16 66.17,30.61 71.25,30.61 72.52,29.34 77.72,29.34 80.01,31.98 82.93,31.98 82.93,39.5 82.93,39.75 82.3,39.75 J4.3 | 67.75,32.92
  Top 0.203: v85.34,46.23 82.93,43.81 82.93,39.5
  Top 0.305: 66.48,32.77 67.12,32.77
  Bottom 0.152: Q1.3 88.2,47.24 R15.1 87.18,46.23 v85.34,46.23
P3.7
  Top 0.152: 69.03,32.77 69.03,32.13 JP13.17 | 69.03,33.32 69.03,33.69 U$1.37
  Top 0.305: 69.03,32.77 69.03,33.32
  Bottom 0.152: JP13.17 68.71,31.11 70.1,29.72 78.23,29.72 77.85,29.97 77.85,41.78 J4.2 80.71,44 R13.1 88.96,42.55 Q2.3
PWRMON  (via drill 0.5)
  Top 0.254: IC1.49 118.85,34.16 v116.2,34.16 | v98.81,35.18 87.25,23.62 JP8.3
  Bottom 0.254: v116.2,34.16 115.19,35.18 v98.81,35.18
RESET  (via drill 0.38)
  Top 0.152: JP13.9 48.78,32.53 49.34,33.08 49.97,33.08 50.29,33.4 51.88,33.4 52.2,33.72 54.42,33.72 54.74,34.04 56.64,34.04 56.96,34.35 58.55,34.35 59.66,35.47 v59.66,35.86 | 61.55,38.01 61.47,37.92 60.69,37.92 60.13,38.48 v59.74,38.48
  Top 0.203: U$1.19 61.55,38.01 | JP12.12 55.88,24.64 JP13.9
  Top 0.305: 48.78,32.53 48.86,32.53 49.34,33 | JP12.12 55.88,9.14 X4.4
  Route2 0.152: v59.74,38.48 59.66,38.48 v59.66,35.86
RXD  (via drill 0.38)
  Top 0.203: v111.15,40.18 111.17,40.2 IC1.26
  Bottom 0.203: R2.1 97.45,40.28 99.97,40.28 100.08,40.18 v111.15,40.18
  Bottom 0.305: Q2.2 92.82,41.85 R2.1
SEL3V3
  Top 0.203: JP9.1 10.67,37.08 10.67,33.53 15.75,28.45 15.75,17.78 13.72,15.75 13.21,16.26 R17.1
SENSE
  Top 0.203: 14.22,22.86 13.72,23.37 12.19,23.37 IC2.2 | 14.22,22.86 14.22,19.81 R14.1 14.22,19.62 14.22,18.29 13.72,17.78 9.14,17.78 8.13,16.76 R16.2 | 14.22,22.86 15.24,23.88 15.24,28.45 10.16,33.53 10.16,35.56 8.64,37.08 8.64,39.62 10.16,39.62 JP9.2
STAT_LED  (via drill 0.5)
  Top 0.254: IC1.45 118.87,35.18 117.86,35.18 115.82,37.21 v115.82,44.2
  Bottom 0.254: v115.82,44.2 109.03,50.99 R5.2
SWDCK  (via drill 0.38, 0.46, 0.6)
  Top 0.152: 47.93,44.53 48.47,45.07 48.47,45.39 48.86,45.78 51.24,45.78 52.36,44.67 52.59,44.67 v53.86,43.4 | v58.86,42.61 61.8,42.61
  Top 0.178: 47.93,44.37 47.93,44.53
  Top 0.203: 61.8,42.61 U$1.12 | v23.37,38.61 22.35,38.61 20.83,37.08 X10.2 | Q3.4 27.94,38.48 27.81,38.61 29.84,38.61 30.23,38.99 45.34,38.99 45.34,41.78 47.93,44.37
  Top 0.254: v25.3,39.12 25.53,39.12 26.26,38.38 27.91,38.38 Q3.4
  Bottom 0.152: v53.86,43.4 53.86,41.58 54.26,41.18 54.58,41.18 55.37,40.39 58.23,40.39 58.86,41.02 v58.86,42.61
  Bottom 0.254: v23.37,38.61 24.79,38.61 v25.3,39.12
SWDIO  (via drill 0.38, 0.6, 0.7)
  Top 0.203: v23.37,34.54 v23.37,37.08 | v56.77,44.07 57.53,43.31 59.05,43.31 59.31,43.05 61.98,43.05 63.37,41.66 U$1.11 | v51.82,44.07 48.13,44.07 45.72,41.66 45.72,38.86 45.47,38.61 34.92,38.61 v34.9,37.72 | v29.97,37.72 29.97,37.47 29.59,37.08 Q3.2
  Top 0.305: Q3.2 25.91,37.08 v25.4,37.59
  Bottom 0.203: v23.37,34.54 20.83,34.54 X10.1 | v51.82,44.07 v56.77,44.07 | v29.97,37.72 v34.9,37.72
  Bottom 0.305: v25.4,37.59 24.89,37.08 v23.37,37.08
SWV
  Top 0.152: 47.43,44.51 48.07,45.15 48.07,45.78 48.39,46.1 49.1,46.1 51.4,46.1 52.36,45.15 54.58,45.15 56.17,43.56 56.17,42.91 56.2,42.88 57.64,42.88 58.55,41.97 61.3,41.97
  Top 0.178: 47.43,44.43 47.43,44.51
  Top 0.203: 61.3,41.97 U$1.14 | Q3.6 27.81,39.5 29.59,39.5 30.35,40.26 43.26,40.26 47.43,44.43
T_ONOFF  (via drill 0.5)
  Top 0.254: JP7.2 93.47,19.81 93.47,20.19 94.74,21.46 96.65,21.46 97.79,22.61 103,22.61 111.96,32.33 v112.12,32.46 | v115.9,32.51 117.22,33.02 117.35,33.15 118.87,33.15 IC1.53
  Bottom 0.254: v115.9,32.51 v112.12,32.46
T_RESET
  Top 0.152: IC1.54 114.26,33.17 113.18,33.17 112.93,32.92 112.93,31.34 103.68,22.1 103.19,22.1
  Top 0.254: 103.19,22.1 97.92,22.1 96.9,21.08 96.9,17.4 JP6.2
TDI  (via drill 0.7)
  Top 0.203: Q3.8 29.72,40.89 30.35,41.53 42.29,41.53 v42.42,41.4 | U$1.15 62.23,40.51 61.98,40.77 61.85,40.77 61.72,40.89 61.72,41.02 61.21,41.53 60.96,41.53 60.83,41.4 v46.99,41.4
  Bottom 0.203: v46.99,41.4 v42.42,41.4
TLOGIC  (via drill 0.5)
  Top 0.254: JP8.2 84.2,21.08 84.2,38.35 90.68,44.83 v93.6,44.83
  Top 0.305: v93.6,44.83 93.98,45.21 v93.98,48.19
  Bottom 0.305: Q1.1 v93.98,48.19 94.23,48.19 R1.2 | Q2.1 92.82,43.75 R2.2 94.8,44.83 v93.6,44.83
TXD  (via drill 0.5)
  Top 0.254: IC1.25 118.83,40.26 v117.09,40.26
  Bottom 0.254: v117.09,40.26 111.06,46.29 R1.1
  Bottom 0.305: Q1.2 R1.1
V_TELIT  (via drill 0.5)
  Top 0.203: J2.1 104.32,66.09 | JP5.1 JP4.1
  Top 0.305: 104.32,66.09 JP5.1 101.73,63.8 101.73,62.1 101.22,61.59 101.22,29.34 100.71,28.83 v100.61,24.54
  Bottom 0.254: Q24.3 98.81,24.81 JP1.3 97.41,19.81 97.28,19.68 97.28,13.08 92.71,13.08 92.2,12.57 92.2,8.26 D2.A
  Bottom 0.305: v100.61,24.54 98.68,24.51 Q24.3
VAUX  (via drill 0.46, 0.5)
  Top 0.254: IC1.50 114.25,34.16 v103.12,34.16
  Top 0.305: v102.13,28.42 101.17,27.46 101.17,25.07 101.42,24.82 101.42,24.21 100.25,23.04 97.59,23.04 96.44,21.89 94.54,21.89 93.9,21.26 93.7,21.26 93.67,21.23 93.67,21.03 93.04,20.4 93.04,20.02 91.87,18.85 91.52,18.85 91.19,18.82 89.84,18.72 88.95,16.97 89.05,15.37 v89,15.27
  Bottom 0.254: v103.12,34.16 102.23,33.27 102.23,28.42 R12.2
  Bottom 0.305: JP8.1 v89,15.27 | v102.13,28.42 102.23,28.42
VBAT  (via drill 0.6, 0.7)
  Top 0.203: 22.35,25.02 v22.35,25.65 | 22.35,25.02 24.13,23.24 v24.77,23.24 | v18.67,36.45 18.67,28.7 22.35,25.02 | R26.2 16.26,48.13 16.26,47.12 16.76,46.61 16.76,43.18 v18.16,43.18
  Top 0.254: v13.72,53.34 12.19,51.82 | v19.81,53.34 19.3,52.83 18.29,52.83 Q22.2
  Top 0.406: 10.16,53.85 8.64,52.32 X1.1 | 10.16,53.85 10.16,56.9 D4.A | 10.16,53.85 12.19,51.82 15.75,48.26 16.26,48.26 16.26,48.77 R26.2
  Bottom 0.203: Q12.2 25.59,23.24 | 25.59,23.24 R19.2 | Q10.2 R18.2 20.7,24.77 20.7,25.65 v22.35,25.65 | 25.59,23.24 v24.77,23.24 | v18.67,36.45 18.67,38.35 18.29,38.73 18.29,39.5 17.65,40.13 17.65,43.18 v18.16,43.18
  Bottom 0.254: v19.81,53.34 v13.72,53.34
VBAT1  (via drill 0.6, 0.7)
  Top 0.203: v18.54,19.18 16.13,21.59 16.13,35.05 19.56,38.48 21.72,38.48 24,40.77 24,49.53 v23.5,50.04 | v24.89,51.44 24.89,54.1 v26.16,55.37
  Top 0.254: X6.5 19.77,58.93 27.43,58.93 27.94,58.42 JP11.1
  Top 0.305: JP12.1 22.35,15.24 21.84,14.73 v19.81,16.76
  Top 0.406: 21.84,14.73 20.33,14.73 X2.5
  Route15 0.203: v24.89,51.44 v23.5,50.04 | JP11.1 v26.16,55.37
  Bottom 0.203: v18.54,19.18 19.68,19.18 Q10.3
  Bottom 0.305: Q10.3 19.81,17.27 20.32,16.76 v19.81,16.76
VBAT2  (via drill 0.6)
  Top 0.305: X2.4 17.78,9.14 17.78,9.65 21.34,13.21 28.45,13.21 JP12.2 30.48,15.75 26.92,19.3 v25.91,19.3
  Bottom 0.305: v25.91,19.3 24.89,19.3 Q12.3
VCCD  (via drill 0.38)
  Top 0.152: v72.04,42.45 71.65,42.45
  Top 0.203: 71.65,42.45 U$1.57 | U$1.26 63.44,35.94 v62.99,35.94
  Bottom 0.203: 71.87,42.45 v72.04,42.45 | v62.99,35.94 | v62.99,35.94 64.74,37.69 64.74,38.48 66.33,40.07 67.2,40.07 67.6,39.67 68.39,39.67 68.63,39.91 68.79,39.91 68.94,40.07 69.66,40.07 v72.04,42.45 | v72.04,42.45
  Bottom 0.305: C17.1 72.76,41.73 v72.04,42.45
VDD  (via drill 0.38, 0.46)
  Top 0.152: 67.44,34.14 U$1.35
  Top 0.203: 67.44,34.14 67.75,33.82 67.75,33.54 67.67,33.46 v66.85,33.53 | 70.52,42.45 v70.85,42.55 70.59,42.53 U$1.59 | 70.41,36.26 v70.83,35.99 70.73,35.94 U$1.44 | U$1.17 61.09,40.49 v61.09,40.7 | U$1.24 63.02,36.66 62.36,36.66 | 62.36,36.66 v62.28,36.66 62.25,36.6 62.36,36.66 | U$1.52 72.41,40.39 72.99,40.39 v73.31,40.07 | U$1.67 68.39,44.85 v68.31,45.12
  Top 0.356: v9.65,30.73 9.65,29.84 9.53,29.72 C2.A | v12.57,29.34 13.21,29.34 13.34,29.21 13.34,27.81 C3.1 | 12.32,19.68 12.32,21.84 IC2.1 | 12.32,19.68 R14.2 | R17.2 v10.29,16.38 | 12.32,19.68 11.3,20.7 v11.18,20.7
  Bottom 0.152: 69.96,36.91 C7.1
  Bottom 0.203: 66.75,33.72 66.8,33.72 v66.85,33.53 | v68.31,45.12 68.31,45.31 67.91,45.31 66.89,44.28 C14.1 | R22.2 Q18.2 | R21.2 Q16.2 | Q14.2 R20.2
  Bottom 0.305: 70.37,42.53 70.06,42.21 69.98,42.21 | 69.98,42.21 69.82,42.21 69.1,42.93 68.87,42.93 | 69.98,42.21 69.98,42.29 | C8.1 70,42.09 70.16,42.09 | 70.16,42.09 69.32,42.93 C16.1 | 70.16,42.09 70.59,42.53 v70.85,42.55 | C11.1 62.03,41.19 61.89,41.19 | 73.31,40.15 v73.31,40.07 74.11,39.27 74.11,38.64 73.43,37.97 C13.1 | v62.28,36.66 62.28,37.38 C15.1 61.81,37.91 C10.1 | C18.1 | C18.1 v66.85,33.53
  Bottom 0.356: R22.2 v41.53,24.77 | v36.45,26.54 36.07,26.16 34.8,26.16 34.67,26.04 34.67,24.77 R21.2 | v31.5,26.42 30.48,26.42 30.35,26.29 30.35,24.77 R20.2 | Q24.2 99.44,27.32 v99.44,29.34 | v70.61,21.59 69.19,21.59 Q20.2 R23.2
  Bottom 0.406: 70.37,42.53 v70.85,42.55 | C7.1 v70.83,35.99 70.93,36.42 70.93,37.4 C12.1 | v61.09,40.7 61.33,40.7 61.4,40.7 61.89,41.19
  pour Route15: 0,0 123.83,0 123.83,73.03 0,73.03
VDD1  (via drill 0.6, 0.7)
  Top 0.203: v28.19,19.3 27.56,19.3 17.02,29.84 v17.02,29.97 | v15.24,30.1 15.75,30.61 15.75,35.18 18.92,38.35 18.92,42.93 19.56,43.56 v22.23,43.56 | v25.27,43.56 24.77,44.07 24.77,50.16 28.7,54.1 v28.7,55.37
  Top 0.254: JP11.2 26.67,60.96 19.3,60.96 18.09,62.17 X6.4
  Top 0.305: X2.3 21.84,9.14 25.4,12.7 28.96,12.7 29.46,13.21 30.99,13.21 JP12.3 31.5,16.76 v31.5,19.3
  Route15 0.203: JP11.2 v28.7,55.37
  Bottom 0.203: v28.19,19.3 29.34,19.3 Q14.3 | v17.02,29.97 16.89,30.1 v15.24,30.1 | v25.27,43.56 v22.23,43.56
  Bottom 0.305: v31.5,19.3 29.46,19.3 Q14.3
VDD2
  Top 0.305: JP12.4 33.53,13.21 32,13.21 31.5,12.7 29.97,12.7 29.46,12.19 28.45,12.19 25.4,9.14 X2.2
  Bottom 0.305: JP12.4 34.04,16.76 34.04,19.3 Q16.3
VDD3  (via drill 0.6)
  Top 0.305: X3.4 37.59,9.14 43.18,14.73 JP12.7 43.18,16.76 v41.15,18.8
  Bottom 0.305: v41.15,18.8 38.61,18.8 Q18.3
VDD4
  Top 0.305: JP12.18 71.12,14.73 75.18,10.67 77.22,10.67 78.74,9.14 X5.3
  Bottom 0.203: Q20.3 71.12,16.17 JP12.18
VDDD
  Top 0.305: Q3.1 32,35.19 C30.1
VTARG  (via drill 0.5)
  Route2 0.203: v84.84,42.16 80.64,46.35 J4.1
  Bottom 0.152: J4.1 82.48,48.32 R15.2
  Bottom 0.203: R13.2 87.44,42.16 v84.84,42.16 | JP4.2 89.53,56.84 89.53,48.13 89.35,48.32 R15.2

## Text on the board
tNames: 0.0 | 0.1 | 0.2 | 0.3 | 0.4 | 0.5 | 0.6 | 0.7 | 1.6 | 15.4 | 15.5 | 2.7 | 2.6 | 2.5 | 2.4 | 2.3 | 2.2 | 2.1 | 2.0 | VDD | !EA | ALE | !PSEN | xtal | RST | 12.0 | 12.1 | 12.2 | 12.3 | 12.4 | 12.5 | 12.6 | 12.7 | 1.7 | 3.0 | 3.1 | 3.2 | 3.3 | 3.4 | 3.5 | 3.6 | 3.7 | MXI | MXO | GND
tSilk: VBAT1 / P0.0 | VDD1 / P0.2 | GND | P0.5 | P0.6 | P0.7 | P1.6 / EA | GND | P15.4 / ALE | P15.5 / PSEN | P2.7 | GND | P2.6 | P2.5 | P2.4 | GND | P2.3 | P2.2 | P2.1 | GND | V TELIT | + | V TARG | - | V TELIT | T LED (EN) | P2.0 | + | POWER | - | VTARG | VDD | BAT | 5V | RXD (P3.7) | GND | TXD (P3.6) | VDD | XRES | SWDCK | GND | REG | 3.3V | RESET (MXO, P15.0) | SWDIO | ON/OFF (MXI, P15.1) | Cell Board V1 2015 / Real-time Water Systems Lab / tinyurl.com/bkerkez | TELIT | VAX-TLOG-PWRM | PUSH-T_ON-P15.1 | PUSH-T_RST-P15.0 | -0.7V-V_TELIT-0V | GND-DTR-VAUX | VBAT1 / P12.0 | VBAT2 / P0.1 | VDD1 / P0.2 | VDD2 / P0.3 | P12.2 | P12.3 | VDD3 / P12.4 | GND | P12.5 | P12.6 | P12.7 | P1.7 / RST | GND | P3.0 | P3.1 | GND | P3.2 | VDD4 / P3.3 | P3.4 | P3.5